# EAGLE board UCirKitBreadboardWithEverythingTop_2Layers-08201626 (EAGLE 7.3.0), part 1 of 2
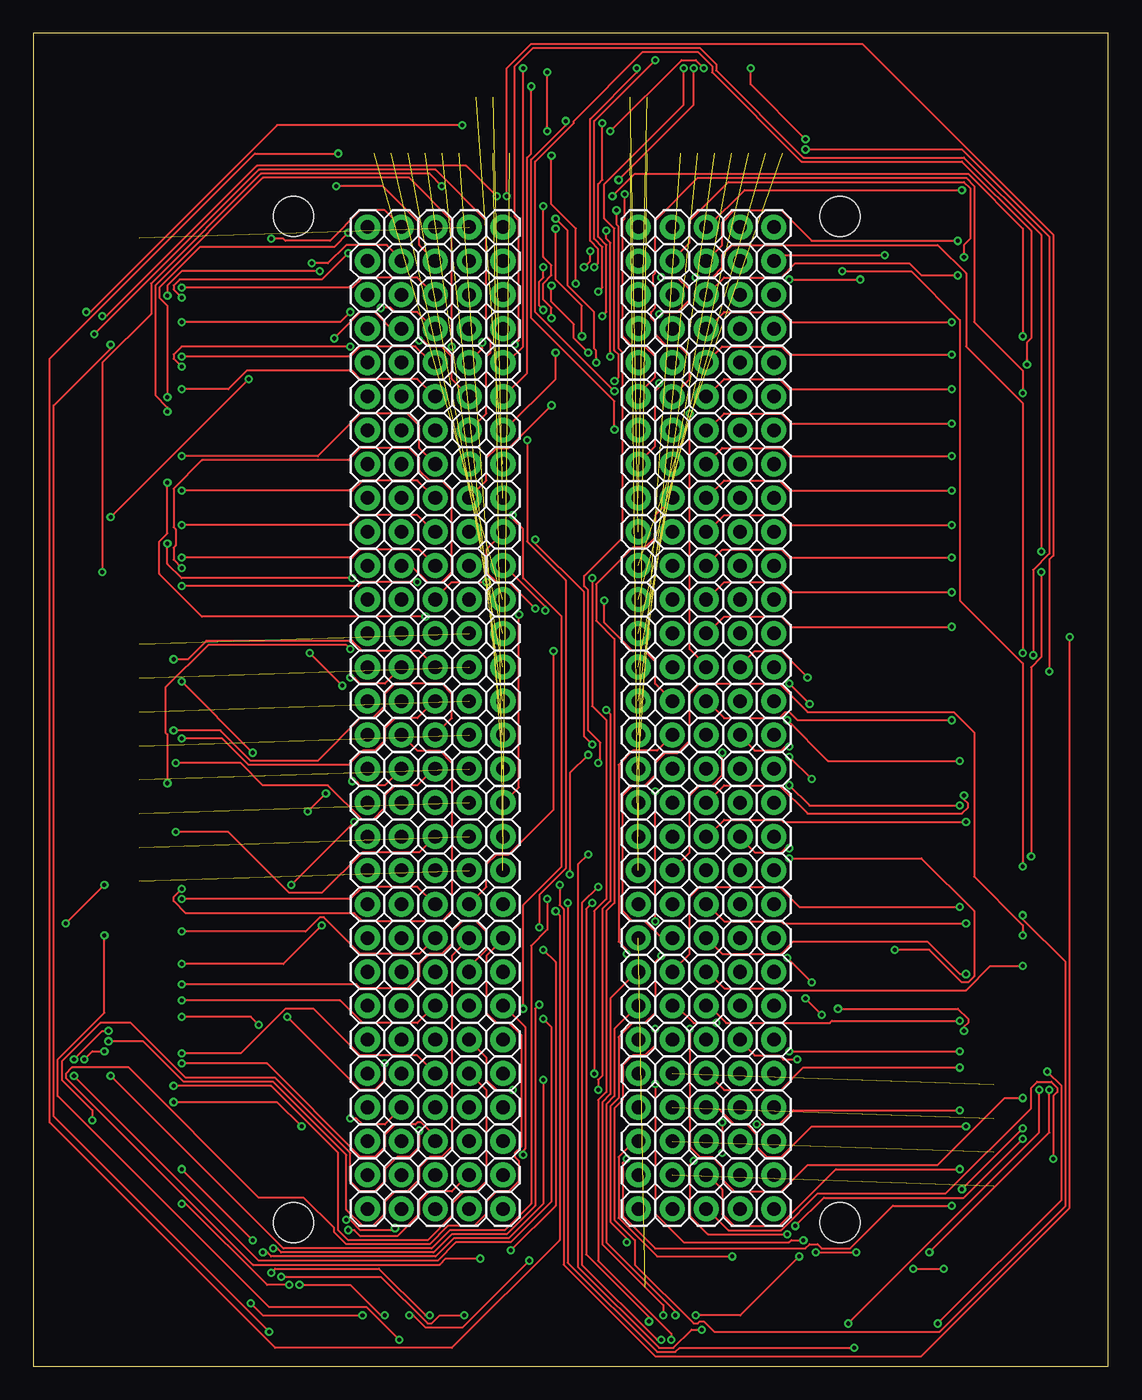
[diagram p2: board, top side]
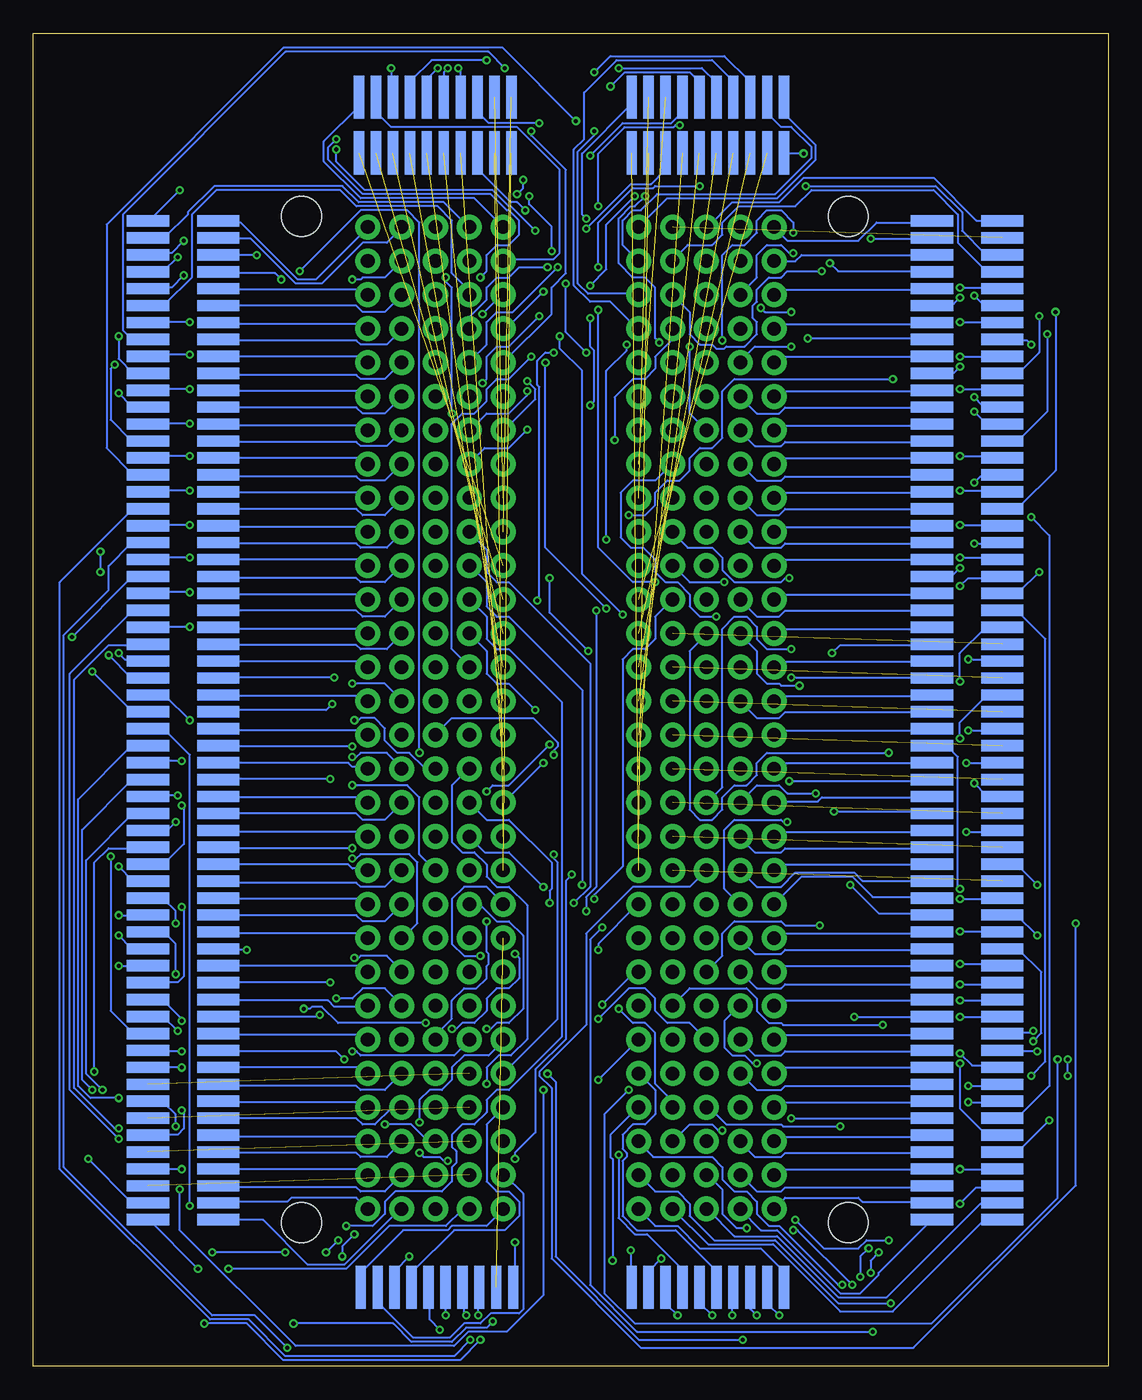
[diagram p3: board, bottom side, seen from below]

Size 80.62 x 100 mm. Coordinates in mm from the lower left corner, seen from the top.
Outline: 0,0 80.62,0 80.62,100 0,100 0,0
Copper layers (1*16): Top 0.035mm / dielectric 1.5mm / Bottom 0.035mm
Design rules "SeeedStudio_2layer_DRU_no_angle_20140221": minimum track width 6mil, minimum drill 12mil, track to track 6mil, track to pad 6mil, pad to pad 6mil, via to via 6mil, smd to smd 0mil, copper to edge 10mil, drill to drill 10mil, minimum pad ring 10mil, minimum via ring 6mil, stop-mask expansion 2mil, vias tented up to drill 100mil, thermal gap 10mil
Holes 3 mm at 19.51,86.27 19.51,10.77 60.51,10.77 60.51,86.27

## Footprints (pad centres in the part's own frame; a part is rotated, then mirrored left to right if it is on the bottom)
1X01_WITHOUT_TEXT = drill 1.016 pad 1.88: 1 0,0
1X01_SMD_3.25X0.85MM_NO_SILK = smd 3.25 x 0.85: P$1 0,0

## Placement (x,y rotation side)
JP1  [1X01_WITHOUT_TEXT]  25.06,85.46 0 top
JP2  [1X01_WITHOUT_TEXT]  27.6,85.46 0 top
JP3  [1X01_WITHOUT_TEXT]  30.14,85.46 0 top
JP4  [1X01_WITHOUT_TEXT]  32.68,85.46 0 top
JP5  [1X01_WITHOUT_TEXT]  35.22,85.46 0 top
JP6  [1X01_WITHOUT_TEXT]  45.38,85.46 0 top
JP7  [1X01_WITHOUT_TEXT]  47.92,85.46 0 top
JP8  [1X01_WITHOUT_TEXT]  50.46,85.46 0 top
JP9  [1X01_WITHOUT_TEXT]  53,85.46 0 top
JP10  [1X01_WITHOUT_TEXT]  55.54,85.46 0 top
JP11  [1X01_WITHOUT_TEXT]  25.06,82.92 0 top
JP12  [1X01_WITHOUT_TEXT]  27.6,82.92 0 top
JP13  [1X01_WITHOUT_TEXT]  30.14,82.92 0 top
JP14  [1X01_WITHOUT_TEXT]  32.68,82.92 0 top
JP15  [1X01_WITHOUT_TEXT]  35.22,82.92 0 top
JP16  [1X01_WITHOUT_TEXT]  45.38,82.92 0 top
JP17  [1X01_WITHOUT_TEXT]  47.92,82.92 0 top
JP18  [1X01_WITHOUT_TEXT]  50.46,82.92 0 top
JP19  [1X01_WITHOUT_TEXT]  53,82.92 0 top
JP20  [1X01_WITHOUT_TEXT]  55.54,82.92 0 top
JP21  [1X01_WITHOUT_TEXT]  25.06,80.38 0 top
JP22  [1X01_WITHOUT_TEXT]  27.6,80.38 0 top
JP23  [1X01_WITHOUT_TEXT]  30.14,80.38 0 top
JP24  [1X01_WITHOUT_TEXT]  32.68,80.38 0 top
JP25  [1X01_WITHOUT_TEXT]  35.22,80.38 0 top
JP26  [1X01_WITHOUT_TEXT]  45.38,80.38 0 top
JP27  [1X01_WITHOUT_TEXT]  47.92,80.38 0 top
JP28  [1X01_WITHOUT_TEXT]  50.46,80.38 0 top
JP29  [1X01_WITHOUT_TEXT]  53,80.38 0 top
JP30  [1X01_WITHOUT_TEXT]  55.54,80.38 0 top
JP31  [1X01_WITHOUT_TEXT]  25.06,77.84 0 top
JP32  [1X01_WITHOUT_TEXT]  27.6,77.84 0 top
JP33  [1X01_WITHOUT_TEXT]  30.14,77.84 0 top
JP34  [1X01_WITHOUT_TEXT]  32.68,77.84 0 top
JP35  [1X01_WITHOUT_TEXT]  35.22,77.84 0 top
JP36  [1X01_WITHOUT_TEXT]  45.38,77.84 0 top
JP37  [1X01_WITHOUT_TEXT]  47.92,77.84 0 top
JP38  [1X01_WITHOUT_TEXT]  50.46,77.84 0 top
JP39  [1X01_WITHOUT_TEXT]  53,77.84 0 top
JP40  [1X01_WITHOUT_TEXT]  55.54,77.84 0 top
JP41  [1X01_WITHOUT_TEXT]  25.06,75.3 0 top
JP42  [1X01_WITHOUT_TEXT]  27.6,75.3 0 top
JP43  [1X01_WITHOUT_TEXT]  30.14,75.3 0 top
JP44  [1X01_WITHOUT_TEXT]  32.68,75.3 0 top
JP45  [1X01_WITHOUT_TEXT]  35.22,75.3 0 top
JP46  [1X01_WITHOUT_TEXT]  45.38,75.3 0 top
JP47  [1X01_WITHOUT_TEXT]  47.92,75.3 0 top
JP48  [1X01_WITHOUT_TEXT]  50.46,75.3 0 top
JP49  [1X01_WITHOUT_TEXT]  53,75.3 0 top
JP50  [1X01_WITHOUT_TEXT]  55.54,75.3 0 top
JP51  [1X01_WITHOUT_TEXT]  25.06,72.76 0 top
JP52  [1X01_WITHOUT_TEXT]  27.6,72.76 0 top
JP53  [1X01_WITHOUT_TEXT]  30.14,72.76 0 top
JP54  [1X01_WITHOUT_TEXT]  32.68,72.76 0 top
JP55  [1X01_WITHOUT_TEXT]  35.22,72.76 0 top
JP56  [1X01_WITHOUT_TEXT]  45.38,72.76 0 top
JP57  [1X01_WITHOUT_TEXT]  47.92,72.76 0 top
JP58  [1X01_WITHOUT_TEXT]  50.46,72.76 0 top
JP59  [1X01_WITHOUT_TEXT]  53,72.76 0 top
JP60  [1X01_WITHOUT_TEXT]  55.54,72.76 0 top
JP61  [1X01_WITHOUT_TEXT]  25.06,70.22 0 top
JP62  [1X01_WITHOUT_TEXT]  27.6,70.22 0 top
JP63  [1X01_WITHOUT_TEXT]  30.14,70.22 0 top
JP64  [1X01_WITHOUT_TEXT]  32.68,70.22 0 top
JP65  [1X01_WITHOUT_TEXT]  35.22,70.22 0 top
JP66  [1X01_WITHOUT_TEXT]  45.38,70.22 0 top
JP67  [1X01_WITHOUT_TEXT]  47.92,70.22 0 top
JP68  [1X01_WITHOUT_TEXT]  50.46,70.22 0 top
JP69  [1X01_WITHOUT_TEXT]  53,70.22 0 top
JP70  [1X01_WITHOUT_TEXT]  55.54,70.22 0 top
JP71  [1X01_WITHOUT_TEXT]  25.06,67.68 0 top
JP72  [1X01_WITHOUT_TEXT]  27.6,67.68 0 top
JP73  [1X01_WITHOUT_TEXT]  30.14,67.68 0 top
JP74  [1X01_WITHOUT_TEXT]  32.68,67.68 0 top
JP75  [1X01_WITHOUT_TEXT]  35.22,67.68 0 top
JP76  [1X01_WITHOUT_TEXT]  45.38,67.68 0 top
JP77  [1X01_WITHOUT_TEXT]  47.92,67.68 0 top
JP78  [1X01_WITHOUT_TEXT]  50.46,67.68 0 top
JP79  [1X01_WITHOUT_TEXT]  53,67.68 0 top
JP80  [1X01_WITHOUT_TEXT]  55.54,67.68 0 top
JP81  [1X01_WITHOUT_TEXT]  25.06,65.14 0 top
JP82  [1X01_WITHOUT_TEXT]  27.6,65.14 0 top
JP83  [1X01_WITHOUT_TEXT]  30.14,65.14 0 top
JP84  [1X01_WITHOUT_TEXT]  32.68,65.14 0 top
JP85  [1X01_WITHOUT_TEXT]  35.22,65.14 0 top
JP86  [1X01_WITHOUT_TEXT]  45.38,65.14 0 top
JP87  [1X01_WITHOUT_TEXT]  47.92,65.14 0 top
JP88  [1X01_WITHOUT_TEXT]  50.46,65.14 0 top
JP89  [1X01_WITHOUT_TEXT]  53,65.14 0 top
JP90  [1X01_WITHOUT_TEXT]  55.54,65.14 0 top
JP91  [1X01_WITHOUT_TEXT]  25.06,62.6 0 top
JP92  [1X01_WITHOUT_TEXT]  27.6,62.6 0 top
JP93  [1X01_WITHOUT_TEXT]  30.14,62.6 0 top
JP94  [1X01_WITHOUT_TEXT]  32.68,62.6 0 top
JP95  [1X01_WITHOUT_TEXT]  35.22,62.6 0 top
JP96  [1X01_WITHOUT_TEXT]  45.38,62.6 0 top
JP97  [1X01_WITHOUT_TEXT]  47.92,62.6 0 top
JP98  [1X01_WITHOUT_TEXT]  50.46,62.6 0 top
JP99  [1X01_WITHOUT_TEXT]  53,62.6 0 top
JP100  [1X01_WITHOUT_TEXT]  55.54,62.6 0 top
JP101  [1X01_WITHOUT_TEXT]  25.06,60.06 0 top
JP102  [1X01_WITHOUT_TEXT]  27.6,60.06 0 top
JP103  [1X01_WITHOUT_TEXT]  30.14,60.06 0 top
JP104  [1X01_WITHOUT_TEXT]  32.68,60.06 0 top
JP105  [1X01_WITHOUT_TEXT]  35.22,60.06 0 top
JP106  [1X01_WITHOUT_TEXT]  45.38,60.06 0 top
JP107  [1X01_WITHOUT_TEXT]  47.92,60.06 0 top
JP108  [1X01_WITHOUT_TEXT]  50.46,60.06 0 top
JP109  [1X01_WITHOUT_TEXT]  53,60.06 0 top
JP110  [1X01_WITHOUT_TEXT]  55.54,60.06 0 top
JP111  [1X01_WITHOUT_TEXT]  25.06,57.52 0 top
JP112  [1X01_WITHOUT_TEXT]  27.6,57.52 0 top
JP113  [1X01_WITHOUT_TEXT]  30.14,57.52 0 top
JP114  [1X01_WITHOUT_TEXT]  32.68,57.52 0 top
JP115  [1X01_WITHOUT_TEXT]  35.22,57.52 0 top
JP116  [1X01_WITHOUT_TEXT]  45.38,57.52 0 top
JP117  [1X01_WITHOUT_TEXT]  47.92,57.52 0 top
JP118  [1X01_WITHOUT_TEXT]  50.46,57.52 0 top
JP119  [1X01_WITHOUT_TEXT]  53,57.52 0 top
JP120  [1X01_WITHOUT_TEXT]  55.54,57.52 0 top
JP121  [1X01_WITHOUT_TEXT]  25.06,54.98 0 top
JP122  [1X01_WITHOUT_TEXT]  27.6,54.98 0 top
JP123  [1X01_WITHOUT_TEXT]  30.14,54.98 0 top
JP124  [1X01_WITHOUT_TEXT]  32.68,54.98 0 top
JP125  [1X01_WITHOUT_TEXT]  35.22,54.98 0 top
JP126  [1X01_WITHOUT_TEXT]  45.38,54.98 0 top
JP127  [1X01_WITHOUT_TEXT]  47.92,54.98 0 top
JP128  [1X01_WITHOUT_TEXT]  50.46,54.98 0 top
JP129  [1X01_WITHOUT_TEXT]  53,54.98 0 top
JP130  [1X01_WITHOUT_TEXT]  55.54,54.98 0 top
JP131  [1X01_WITHOUT_TEXT]  25.06,52.44 0 top
JP132  [1X01_WITHOUT_TEXT]  27.6,52.44 0 top
JP133  [1X01_WITHOUT_TEXT]  30.14,52.44 0 top
JP134  [1X01_WITHOUT_TEXT]  32.68,52.44 0 top
JP135  [1X01_WITHOUT_TEXT]  35.22,52.44 0 top
JP136  [1X01_WITHOUT_TEXT]  45.38,52.44 0 top
JP137  [1X01_WITHOUT_TEXT]  47.92,52.44 0 top
JP138  [1X01_WITHOUT_TEXT]  50.46,52.44 0 top
JP139  [1X01_WITHOUT_TEXT]  53,52.44 0 top
JP140  [1X01_WITHOUT_TEXT]  55.54,52.44 0 top
JP141  [1X01_WITHOUT_TEXT]  25.06,49.9 0 top
JP142  [1X01_WITHOUT_TEXT]  27.6,49.9 0 top
JP143  [1X01_WITHOUT_TEXT]  30.14,49.9 0 top
JP144  [1X01_WITHOUT_TEXT]  32.68,49.9 0 top
JP145  [1X01_WITHOUT_TEXT]  35.22,49.9 0 top
JP146  [1X01_WITHOUT_TEXT]  45.38,49.9 0 top
JP147  [1X01_WITHOUT_TEXT]  47.92,49.9 0 top
JP148  [1X01_WITHOUT_TEXT]  50.46,49.9 0 top
JP149  [1X01_WITHOUT_TEXT]  53,49.9 0 top
JP150  [1X01_WITHOUT_TEXT]  55.54,49.9 0 top
JP151  [1X01_WITHOUT_TEXT]  25.06,47.36 0 top
JP152  [1X01_WITHOUT_TEXT]  27.6,47.36 0 top
JP153  [1X01_WITHOUT_TEXT]  30.14,47.36 0 top
JP154  [1X01_WITHOUT_TEXT]  32.68,47.36 0 top
JP155  [1X01_WITHOUT_TEXT]  35.22,47.36 0 top
JP156  [1X01_WITHOUT_TEXT]  45.38,47.36 0 top
JP157  [1X01_WITHOUT_TEXT]  47.92,47.36 0 top
JP158  [1X01_WITHOUT_TEXT]  50.46,47.36 0 top
JP159  [1X01_WITHOUT_TEXT]  53,47.36 0 top
JP160  [1X01_WITHOUT_TEXT]  55.54,47.36 0 top
JP161  [1X01_WITHOUT_TEXT]  25.06,44.82 0 top
JP162  [1X01_WITHOUT_TEXT]  27.6,44.82 0 top
JP163  [1X01_WITHOUT_TEXT]  30.14,44.82 0 top
JP164  [1X01_WITHOUT_TEXT]  32.68,44.82 0 top
JP165  [1X01_WITHOUT_TEXT]  35.22,44.82 0 top
JP166  [1X01_WITHOUT_TEXT]  45.38,44.82 0 top
JP167  [1X01_WITHOUT_TEXT]  47.92,44.82 0 top
JP168  [1X01_WITHOUT_TEXT]  50.46,44.82 0 top
JP169  [1X01_WITHOUT_TEXT]  53,44.82 0 top
JP170  [1X01_WITHOUT_TEXT]  55.54,44.82 0 top
JP171  [1X01_WITHOUT_TEXT]  25.06,42.28 0 top
JP172  [1X01_WITHOUT_TEXT]  27.6,42.28 0 top
JP173  [1X01_WITHOUT_TEXT]  30.14,42.28 0 top
JP174  [1X01_WITHOUT_TEXT]  32.68,42.28 0 top
JP175  [1X01_WITHOUT_TEXT]  35.22,42.28 0 top
JP176  [1X01_WITHOUT_TEXT]  45.38,42.28 0 top
JP177  [1X01_WITHOUT_TEXT]  47.92,42.28 0 top
JP178  [1X01_WITHOUT_TEXT]  50.46,42.28 0 top
JP179  [1X01_WITHOUT_TEXT]  53,42.28 0 top
JP180  [1X01_WITHOUT_TEXT]  55.54,42.28 0 top
JP181  [1X01_WITHOUT_TEXT]  25.06,39.74 0 top
JP182  [1X01_WITHOUT_TEXT]  27.6,39.74 0 top
JP183  [1X01_WITHOUT_TEXT]  30.14,39.74 0 top
JP184  [1X01_WITHOUT_TEXT]  32.68,39.74 0 top
JP185  [1X01_WITHOUT_TEXT]  35.22,39.74 0 top
JP186  [1X01_WITHOUT_TEXT]  45.38,39.74 0 top
JP187  [1X01_WITHOUT_TEXT]  47.92,39.74 0 top
JP188  [1X01_WITHOUT_TEXT]  50.46,39.74 0 top
JP189  [1X01_WITHOUT_TEXT]  53,39.74 0 top
JP190  [1X01_WITHOUT_TEXT]  55.54,39.74 0 top
JP191  [1X01_WITHOUT_TEXT]  25.06,37.2 0 top
JP192  [1X01_WITHOUT_TEXT]  27.6,37.2 0 top
JP193  [1X01_WITHOUT_TEXT]  30.14,37.2 0 top
JP194  [1X01_WITHOUT_TEXT]  32.68,37.2 0 top
JP195  [1X01_WITHOUT_TEXT]  35.22,37.2 0 top
JP196  [1X01_WITHOUT_TEXT]  45.38,37.2 0 top
JP197  [1X01_WITHOUT_TEXT]  47.92,37.2 0 top
JP198  [1X01_WITHOUT_TEXT]  50.46,37.2 0 top
JP199  [1X01_WITHOUT_TEXT]  53,37.2 0 top
JP200  [1X01_WITHOUT_TEXT]  55.54,37.2 0 top
JP201  [1X01_WITHOUT_TEXT]  25.06,34.66 0 top
JP202  [1X01_WITHOUT_TEXT]  27.6,34.66 0 top
JP203  [1X01_WITHOUT_TEXT]  30.14,34.66 0 top
JP204  [1X01_WITHOUT_TEXT]  32.68,34.66 0 top
JP205  [1X01_WITHOUT_TEXT]  35.22,34.66 0 top
JP206  [1X01_WITHOUT_TEXT]  45.38,34.66 0 top
JP207  [1X01_WITHOUT_TEXT]  47.92,34.66 0 top
JP208  [1X01_WITHOUT_TEXT]  50.46,34.66 0 top
JP209  [1X01_WITHOUT_TEXT]  53,34.66 0 top
JP210  [1X01_WITHOUT_TEXT]  55.54,34.66 0 top
JP211  [1X01_WITHOUT_TEXT]  25.06,32.12 0 top
JP212  [1X01_WITHOUT_TEXT]  27.6,32.12 0 top
JP213  [1X01_WITHOUT_TEXT]  30.14,32.12 0 top
JP214  [1X01_WITHOUT_TEXT]  32.68,32.12 0 top
JP215  [1X01_WITHOUT_TEXT]  35.22,32.12 0 top
JP216  [1X01_WITHOUT_TEXT]  45.38,32.12 0 top
JP217  [1X01_WITHOUT_TEXT]  47.92,32.12 0 top
JP218  [1X01_WITHOUT_TEXT]  50.46,32.12 0 top
JP219  [1X01_WITHOUT_TEXT]  53,32.12 0 top
JP220  [1X01_WITHOUT_TEXT]  55.54,32.12 0 top
JP221  [1X01_WITHOUT_TEXT]  25.06,29.58 0 top
JP222  [1X01_WITHOUT_TEXT]  27.6,29.58 0 top
JP223  [1X01_WITHOUT_TEXT]  30.14,29.58 0 top
JP224  [1X01_WITHOUT_TEXT]  32.68,29.58 0 top
JP225  [1X01_WITHOUT_TEXT]  35.22,29.58 0 top
JP226  [1X01_WITHOUT_TEXT]  45.38,29.58 0 top
JP227  [1X01_WITHOUT_TEXT]  47.92,29.58 0 top
JP228  [1X01_WITHOUT_TEXT]  50.46,29.58 0 top
JP229  [1X01_WITHOUT_TEXT]  53,29.58 0 top
JP230  [1X01_WITHOUT_TEXT]  55.54,29.58 0 top
JP231  [1X01_WITHOUT_TEXT]  25.06,27.04 0 top
JP232  [1X01_WITHOUT_TEXT]  27.6,27.04 0 top
JP233  [1X01_WITHOUT_TEXT]  30.14,27.04 0 top
JP234  [1X01_WITHOUT_TEXT]  32.68,27.04 0 top
JP235  [1X01_WITHOUT_TEXT]  35.22,27.04 0 top
JP236  [1X01_WITHOUT_TEXT]  45.38,27.04 0 top
JP237  [1X01_WITHOUT_TEXT]  47.92,27.04 0 top
JP238  [1X01_WITHOUT_TEXT]  50.46,27.04 0 top
JP239  [1X01_WITHOUT_TEXT]  53,27.04 0 top
JP240  [1X01_WITHOUT_TEXT]  55.54,27.04 0 top
JP241  [1X01_WITHOUT_TEXT]  25.06,24.5 0 top
JP242  [1X01_WITHOUT_TEXT]  27.6,24.5 0 top
JP243  [1X01_WITHOUT_TEXT]  30.14,24.5 0 top
JP244  [1X01_WITHOUT_TEXT]  32.68,24.5 0 top
JP245  [1X01_WITHOUT_TEXT]  35.22,24.5 0 top
JP246  [1X01_WITHOUT_TEXT]  45.38,24.5 0 top
JP247  [1X01_WITHOUT_TEXT]  47.92,24.5 0 top
JP248  [1X01_WITHOUT_TEXT]  50.46,24.5 0 top
JP249  [1X01_WITHOUT_TEXT]  53,24.5 0 top
JP250  [1X01_WITHOUT_TEXT]  55.54,24.5 0 top
JP251  [1X01_WITHOUT_TEXT]  25.06,21.96 0 top
JP252  [1X01_WITHOUT_TEXT]  27.6,21.96 0 top
JP253  [1X01_WITHOUT_TEXT]  30.14,21.96 0 top
JP254  [1X01_WITHOUT_TEXT]  32.68,21.96 0 top
JP255  [1X01_WITHOUT_TEXT]  35.22,21.96 0 top
JP256  [1X01_WITHOUT_TEXT]  45.38,21.96 0 top
JP257  [1X01_WITHOUT_TEXT]  47.92,21.96 0 top
JP258  [1X01_WITHOUT_TEXT]  50.46,21.96 0 top
JP259  [1X01_WITHOUT_TEXT]  53,21.96 0 top
JP260  [1X01_WITHOUT_TEXT]  55.54,21.96 0 top
JP261  [1X01_WITHOUT_TEXT]  25.06,19.42 0 top
JP262  [1X01_WITHOUT_TEXT]  27.6,19.42 0 top
JP263  [1X01_WITHOUT_TEXT]  30.14,19.42 0 top
JP264  [1X01_WITHOUT_TEXT]  32.68,19.42 0 top
JP265  [1X01_WITHOUT_TEXT]  35.22,19.42 0 top
JP266  [1X01_WITHOUT_TEXT]  45.38,19.42 0 top
JP267  [1X01_WITHOUT_TEXT]  47.92,19.42 0 top
JP268  [1X01_WITHOUT_TEXT]  50.46,19.42 0 top
JP269  [1X01_WITHOUT_TEXT]  53,19.42 0 top
JP270  [1X01_WITHOUT_TEXT]  55.54,19.42 0 top
JP271  [1X01_WITHOUT_TEXT]  25.06,16.88 0 top
JP272  [1X01_WITHOUT_TEXT]  27.6,16.88 0 top
JP273  [1X01_WITHOUT_TEXT]  30.14,16.88 0 top
JP274  [1X01_WITHOUT_TEXT]  32.68,16.88 0 top
JP275  [1X01_WITHOUT_TEXT]  35.22,16.88 0 top
JP276  [1X01_WITHOUT_TEXT]  45.38,16.88 0 top
JP277  [1X01_WITHOUT_TEXT]  47.92,16.88 0 top
JP278  [1X01_WITHOUT_TEXT]  50.46,16.88 0 top
JP279  [1X01_WITHOUT_TEXT]  53,16.88 0 top
JP280  [1X01_WITHOUT_TEXT]  55.54,16.88 0 top
JP281  [1X01_WITHOUT_TEXT]  25.06,14.34 0 top
JP282  [1X01_WITHOUT_TEXT]  27.6,14.34 0 top
JP283  [1X01_WITHOUT_TEXT]  30.14,14.34 0 top
JP284  [1X01_WITHOUT_TEXT]  32.68,14.34 0 top
JP285  [1X01_WITHOUT_TEXT]  35.22,14.34 0 top
JP286  [1X01_WITHOUT_TEXT]  45.38,14.34 0 top
JP287  [1X01_WITHOUT_TEXT]  47.92,14.34 0 top
JP288  [1X01_WITHOUT_TEXT]  50.46,14.34 0 top
JP289  [1X01_WITHOUT_TEXT]  53,14.34 0 top
JP290  [1X01_WITHOUT_TEXT]  55.54,14.34 0 top
JP291  [1X01_WITHOUT_TEXT]  25.06,11.8 0 top
JP292  [1X01_WITHOUT_TEXT]  27.6,11.8 0 top
JP293  [1X01_WITHOUT_TEXT]  30.14,11.8 0 top
JP294  [1X01_WITHOUT_TEXT]  32.68,11.8 0 top
JP295  [1X01_WITHOUT_TEXT]  35.22,11.8 0 top
JP296  [1X01_WITHOUT_TEXT]  45.38,11.8 0 top
JP297  [1X01_WITHOUT_TEXT]  47.92,11.8 0 top
JP298  [1X01_WITHOUT_TEXT]  50.46,11.8 0 top
JP299  [1X01_WITHOUT_TEXT]  53,11.8 0 top
JP300  [1X01_WITHOUT_TEXT]  55.54,11.8 0 top
JP901  [1X01_SMD_3.25X0.85MM_NO_SILK]  7.96,85.92 0 bottom
JP902  [1X01_SMD_3.25X0.85MM_NO_SILK]  7.96,84.65 0 bottom
JP903  [1X01_SMD_3.25X0.85MM_NO_SILK]  7.96,83.38 0 bottom
JP904  [1X01_SMD_3.25X0.85MM_NO_SILK]  7.96,82.11 0 bottom
JP905  [1X01_SMD_3.25X0.85MM_NO_SILK]  7.96,80.84 0 bottom
JP906  [1X01_SMD_3.25X0.85MM_NO_SILK]  7.96,79.57 0 bottom
JP907  [1X01_SMD_3.25X0.85MM_NO_SILK]  7.96,78.3 0 bottom
JP908  [1X01_SMD_3.25X0.85MM_NO_SILK]  7.96,77.03 0 bottom
JP909  [1X01_SMD_3.25X0.85MM_NO_SILK]  7.96,75.76 0 bottom
JP910  [1X01_SMD_3.25X0.85MM_NO_SILK]  7.96,74.49 0 bottom
JP911  [1X01_SMD_3.25X0.85MM_NO_SILK]  7.96,73.22 0 bottom
JP912  [1X01_SMD_3.25X0.85MM_NO_SILK]  7.96,71.95 0 bottom
JP913  [1X01_SMD_3.25X0.85MM_NO_SILK]  7.96,70.68 0 bottom
JP914  [1X01_SMD_3.25X0.85MM_NO_SILK]  7.96,69.41 0 bottom
JP915  [1X01_SMD_3.25X0.85MM_NO_SILK]  7.96,68.14 0 bottom
JP916  [1X01_SMD_3.25X0.85MM_NO_SILK]  7.96,66.87 0 bottom
JP917  [1X01_SMD_3.25X0.85MM_NO_SILK]  7.96,65.6 0 bottom
JP918  [1X01_SMD_3.25X0.85MM_NO_SILK]  7.96,64.33 0 bottom
JP919  [1X01_SMD_3.25X0.85MM_NO_SILK]  7.96,63.06 0 bottom
JP920  [1X01_SMD_3.25X0.85MM_NO_SILK]  7.96,61.79 0 bottom
JP921  [1X01_SMD_3.25X0.85MM_NO_SILK]  7.96,60.52 0 bottom
JP922  [1X01_SMD_3.25X0.85MM_NO_SILK]  7.96,59.25 0 bottom
JP923  [1X01_SMD_3.25X0.85MM_NO_SILK]  7.96,57.98 0 bottom
JP924  [1X01_SMD_3.25X0.85MM_NO_SILK]  7.96,56.71 0 bottom
JP925  [1X01_SMD_3.25X0.85MM_NO_SILK]  7.96,55.44 0 bottom
JP926  [1X01_SMD_3.25X0.85MM_NO_SILK]  7.96,54.17 0 bottom
JP927  [1X01_SMD_3.25X0.85MM_NO_SILK]  7.96,52.9 0 bottom
JP928  [1X01_SMD_3.25X0.85MM_NO_SILK]  7.96,51.63 0 bottom
JP929  [1X01_SMD_3.25X0.85MM_NO_SILK]  7.96,50.36 0 bottom
JP930  [1X01_SMD_3.25X0.85MM_NO_SILK]  7.96,49.09 0 bottom
JP931  [1X01_SMD_3.25X0.85MM_NO_SILK]  7.96,47.82 0 bottom
JP932  [1X01_SMD_3.25X0.85MM_NO_SILK]  7.96,46.55 0 bottom
JP933  [1X01_SMD_3.25X0.85MM_NO_SILK]  7.96,45.28 0 bottom
JP934  [1X01_SMD_3.25X0.85MM_NO_SILK]  7.96,44.01 0 bottom
JP935  [1X01_SMD_3.25X0.85MM_NO_SILK]  7.96,42.74 0 bottom
JP936  [1X01_SMD_3.25X0.85MM_NO_SILK]  7.96,41.47 0 bottom
JP937  [1X01_SMD_3.25X0.85MM_NO_SILK]  7.96,40.2 0 bottom
JP938  [1X01_SMD_3.25X0.85MM_NO_SILK]  7.96,38.93 0 bottom
JP939  [1X01_SMD_3.25X0.85MM_NO_SILK]  7.96,37.66 0 bottom
JP940  [1X01_SMD_3.25X0.85MM_NO_SILK]  7.96,36.39 0 bottom
JP941  [1X01_SMD_3.25X0.85MM_NO_SILK]  7.96,35.12 0 bottom
JP942  [1X01_SMD_3.25X0.85MM_NO_SILK]  7.96,33.85 0 bottom
JP943  [1X01_SMD_3.25X0.85MM_NO_SILK]  7.96,32.58 0 bottom
JP944  [1X01_SMD_3.25X0.85MM_NO_SILK]  7.96,31.31 0 bottom
JP945  [1X01_SMD_3.25X0.85MM_NO_SILK]  7.96,30.04 0 bottom
JP946  [1X01_SMD_3.25X0.85MM_NO_SILK]  7.96,28.77 0 bottom
JP947  [1X01_SMD_3.25X0.85MM_NO_SILK]  7.96,27.5 0 bottom
JP948  [1X01_SMD_3.25X0.85MM_NO_SILK]  7.96,26.23 0 bottom
JP949  [1X01_SMD_3.25X0.85MM_NO_SILK]  7.96,24.96 0 bottom
JP950  [1X01_SMD_3.25X0.85MM_NO_SILK]  7.96,23.69 0 bottom
JP951  [1X01_SMD_3.25X0.85MM_NO_SILK]  7.96,22.42 0 bottom
JP952  [1X01_SMD_3.25X0.85MM_NO_SILK]  7.96,21.15 0 bottom
JP953  [1X01_SMD_3.25X0.85MM_NO_SILK]  7.96,19.88 0 bottom
JP954  [1X01_SMD_3.25X0.85MM_NO_SILK]  7.96,18.61 0 bottom
JP955  [1X01_SMD_3.25X0.85MM_NO_SILK]  7.96,17.34 0 bottom
JP956  [1X01_SMD_3.25X0.85MM_NO_SILK]  7.96,16.07 0 bottom
JP957  [1X01_SMD_3.25X0.85MM_NO_SILK]  7.96,14.8 0 bottom
JP958  [1X01_SMD_3.25X0.85MM_NO_SILK]  7.96,13.53 0 bottom
JP959  [1X01_SMD_3.25X0.85MM_NO_SILK]  7.96,12.26 0 bottom
JP960  [1X01_SMD_3.25X0.85MM_NO_SILK]  7.96,10.99 0 bottom
JP961  [1X01_SMD_3.25X0.85MM_NO_SILK]  13.23,85.92 0 bottom
JP962  [1X01_SMD_3.25X0.85MM_NO_SILK]  13.23,84.65 0 bottom
JP963  [1X01_SMD_3.25X0.85MM_NO_SILK]  13.23,83.38 0 bottom
JP964  [1X01_SMD_3.25X0.85MM_NO_SILK]  13.23,82.11 0 bottom
JP965  [1X01_SMD_3.25X0.85MM_NO_SILK]  13.23,80.84 0 bottom
JP966  [1X01_SMD_3.25X0.85MM_NO_SILK]  13.23,79.57 0 bottom
JP967  [1X01_SMD_3.25X0.85MM_NO_SILK]  13.23,78.3 0 bottom
JP968  [1X01_SMD_3.25X0.85MM_NO_SILK]  13.23,77.03 0 bottom
JP969  [1X01_SMD_3.25X0.85MM_NO_SILK]  13.23,75.76 0 bottom
JP970  [1X01_SMD_3.25X0.85MM_NO_SILK]  13.23,74.49 0 bottom
JP971  [1X01_SMD_3.25X0.85MM_NO_SILK]  13.23,73.22 0 bottom
JP972  [1X01_SMD_3.25X0.85MM_NO_SILK]  13.23,71.95 0 bottom
JP973  [1X01_SMD_3.25X0.85MM_NO_SILK]  13.23,70.68 0 bottom
JP974  [1X01_SMD_3.25X0.85MM_NO_SILK]  13.23,69.41 0 bottom
JP975  [1X01_SMD_3.25X0.85MM_NO_SILK]  13.23,68.14 0 bottom
JP976  [1X01_SMD_3.25X0.85MM_NO_SILK]  13.23,66.87 0 bottom
JP977  [1X01_SMD_3.25X0.85MM_NO_SILK]  13.23,65.6 0 bottom
JP978  [1X01_SMD_3.25X0.85MM_NO_SILK]  13.23,64.33 0 bottom
JP979  [1X01_SMD_3.25X0.85MM_NO_SILK]  13.23,63.06 0 bottom
JP980  [1X01_SMD_3.25X0.85MM_NO_SILK]  13.23,61.79 0 bottom
JP981  [1X01_SMD_3.25X0.85MM_NO_SILK]  13.23,60.52 0 bottom
JP982  [1X01_SMD_3.25X0.85MM_NO_SILK]  13.23,59.25 0 bottom
JP983  [1X01_SMD_3.25X0.85MM_NO_SILK]  13.23,57.98 0 bottom
JP984  [1X01_SMD_3.25X0.85MM_NO_SILK]  13.23,56.71 0 bottom
JP985  [1X01_SMD_3.25X0.85MM_NO_SILK]  13.23,55.44 0 bottom
JP986  [1X01_SMD_3.25X0.85MM_NO_SILK]  13.23,54.17 0 bottom
JP987  [1X01_SMD_3.25X0.85MM_NO_SILK]  13.23,52.9 0 bottom
JP988  [1X01_SMD_3.25X0.85MM_NO_SILK]  13.23,51.63 0 bottom
JP989  [1X01_SMD_3.25X0.85MM_NO_SILK]  13.23,50.36 0 bottom
JP990  [1X01_SMD_3.25X0.85MM_NO_SILK]  13.23,49.09 0 bottom
JP991  [1X01_SMD_3.25X0.85MM_NO_SILK]  13.23,47.82 0 bottom
JP992  [1X01_SMD_3.25X0.85MM_NO_SILK]  13.23,46.55 0 bottom
JP993  [1X01_SMD_3.25X0.85MM_NO_SILK]  13.23,45.28 0 bottom
JP994  [1X01_SMD_3.25X0.85MM_NO_SILK]  13.23,44.01 0 bottom
JP995  [1X01_SMD_3.25X0.85MM_NO_SILK]  13.23,42.74 0 bottom
JP996  [1X01_SMD_3.25X0.85MM_NO_SILK]  13.23,41.47 0 bottom
JP997  [1X01_SMD_3.25X0.85MM_NO_SILK]  13.23,40.2 0 bottom
JP998  [1X01_SMD_3.25X0.85MM_NO_SILK]  13.23,38.93 0 bottom
JP999  [1X01_SMD_3.25X0.85MM_NO_SILK]  13.23,37.66 0 bottom
JP1000  [1X01_SMD_3.25X0.85MM_NO_SILK]  13.23,36.39 0 bottom
JP1001  [1X01_SMD_3.25X0.85MM_NO_SILK]  13.23,35.12 0 bottom
JP1002  [1X01_SMD_3.25X0.85MM_NO_SILK]  13.23,33.85 0 bottom
JP1003  [1X01_SMD_3.25X0.85MM_NO_SILK]  13.23,32.58 0 bottom
JP1004  [1X01_SMD_3.25X0.85MM_NO_SILK]  13.23,31.31 0 bottom
JP1005  [1X01_SMD_3.25X0.85MM_NO_SILK]  13.23,30.04 0 bottom
JP1006  [1X01_SMD_3.25X0.85MM_NO_SILK]  13.23,28.77 0 bottom
JP1007  [1X01_SMD_3.25X0.85MM_NO_SILK]  13.23,27.5 0 bottom
JP1008  [1X01_SMD_3.25X0.85MM_NO_SILK]  13.23,26.23 0 bottom
JP1009  [1X01_SMD_3.25X0.85MM_NO_SILK]  13.23,24.96 0 bottom
JP1010  [1X01_SMD_3.25X0.85MM_NO_SILK]  13.23,23.69 0 bottom
JP1011  [1X01_SMD_3.25X0.85MM_NO_SILK]  13.23,22.42 0 bottom
JP1012  [1X01_SMD_3.25X0.85MM_NO_SILK]  13.23,21.15 0 bottom
JP1013  [1X01_SMD_3.25X0.85MM_NO_SILK]  13.23,19.88 0 bottom
JP1014  [1X01_SMD_3.25X0.85MM_NO_SILK]  13.23,18.61 0 bottom
JP1015  [1X01_SMD_3.25X0.85MM_NO_SILK]  13.23,17.34 0 bottom
JP1016  [1X01_SMD_3.25X0.85MM_NO_SILK]  13.23,16.07 0 bottom
JP1017  [1X01_SMD_3.25X0.85MM_NO_SILK]  13.23,14.8 0 bottom
JP1018  [1X01_SMD_3.25X0.85MM_NO_SILK]  13.23,13.53 0 bottom
JP1019  [1X01_SMD_3.25X0.85MM_NO_SILK]  13.23,12.26 0 bottom
JP1020  [1X01_SMD_3.25X0.85MM_NO_SILK]  13.23,10.99 0 bottom
JP1021  [1X01_SMD_3.25X0.85MM_NO_SILK]  66.76,85.92 0 bottom
JP1022  [1X01_SMD_3.25X0.85MM_NO_SILK]  66.76,84.65 0 bottom
JP1023  [1X01_SMD_3.25X0.85MM_NO_SILK]  66.76,83.38 0 bottom
JP1024  [1X01_SMD_3.25X0.85MM_NO_SILK]  66.76,82.11 0 bottom
JP1025  [1X01_SMD_3.25X0.85MM_NO_SILK]  66.76,80.84 0 bottom
JP1026  [1X01_SMD_3.25X0.85MM_NO_SILK]  66.76,79.57 0 bottom
JP1027  [1X01_SMD_3.25X0.85MM_NO_SILK]  66.76,78.3 0 bottom
JP1028  [1X01_SMD_3.25X0.85MM_NO_SILK]  66.76,77.03 0 bottom
JP1029  [1X01_SMD_3.25X0.85MM_NO_SILK]  66.76,75.76 0 bottom
JP1030  [1X01_SMD_3.25X0.85MM_NO_SILK]  66.76,74.49 0 bottom
JP1031  [1X01_SMD_3.25X0.85MM_NO_SILK]  66.76,73.22 0 bottom
JP1032  [1X01_SMD_3.25X0.85MM_NO_SILK]  66.76,71.95 0 bottom
JP1033  [1X01_SMD_3.25X0.85MM_NO_SILK]  66.76,70.68 0 bottom
JP1034  [1X01_SMD_3.25X0.85MM_NO_SILK]  66.76,69.41 0 bottom
JP1035  [1X01_SMD_3.25X0.85MM_NO_SILK]  66.76,68.14 0 bottom
JP1036  [1X01_SMD_3.25X0.85MM_NO_SILK]  66.76,66.87 0 bottom
JP1037  [1X01_SMD_3.25X0.85MM_NO_SILK]  66.76,65.6 0 bottom
JP1038  [1X01_SMD_3.25X0.85MM_NO_SILK]  66.76,64.33 0 bottom
JP1039  [1X01_SMD_3.25X0.85MM_NO_SILK]  66.76,63.06 0 bottom
JP1040  [1X01_SMD_3.25X0.85MM_NO_SILK]  66.76,61.79 0 bottom
JP1041  [1X01_SMD_3.25X0.85MM_NO_SILK]  66.76,60.52 0 bottom
JP1042  [1X01_SMD_3.25X0.85MM_NO_SILK]  66.76,59.25 0 bottom
JP1043  [1X01_SMD_3.25X0.85MM_NO_SILK]  66.76,57.98 0 bottom
JP1044  [1X01_SMD_3.25X0.85MM_NO_SILK]  66.76,56.71 0 bottom
JP1045  [1X01_SMD_3.25X0.85MM_NO_SILK]  66.76,55.44 0 bottom
JP1046  [1X01_SMD_3.25X0.85MM_NO_SILK]  66.76,54.17 0 bottom
JP1047  [1X01_SMD_3.25X0.85MM_NO_SILK]  66.76,52.9 0 bottom
JP1048  [1X01_SMD_3.25X0.85MM_NO_SILK]  66.76,51.63 0 bottom
JP1049  [1X01_SMD_3.25X0.85MM_NO_SILK]  66.76,50.36 0 bottom
JP1050  [1X01_SMD_3.25X0.85MM_NO_SILK]  66.76,49.09 0 bottom
JP1051  [1X01_SMD_3.25X0.85MM_NO_SILK]  66.76,47.82 0 bottom
JP1052  [1X01_SMD_3.25X0.85MM_NO_SILK]  66.76,46.55 0 bottom
JP1053  [1X01_SMD_3.25X0.85MM_NO_SILK]  66.76,45.28 0 bottom
JP1054  [1X01_SMD_3.25X0.85MM_NO_SILK]  66.76,44.01 0 bottom
JP1055  [1X01_SMD_3.25X0.85MM_NO_SILK]  66.76,42.74 0 bottom
JP1056  [1X01_SMD_3.25X0.85MM_NO_SILK]  66.76,41.47 0 bottom
JP1057  [1X01_SMD_3.25X0.85MM_NO_SILK]  66.76,40.2 0 bottom
JP1058  [1X01_SMD_3.25X0.85MM_NO_SILK]  66.76,38.93 0 bottom
JP1059  [1X01_SMD_3.25X0.85MM_NO_SILK]  66.76,37.66 0 bottom
JP1060  [1X01_SMD_3.25X0.85MM_NO_SILK]  66.76,36.39 0 bottom
JP1061  [1X01_SMD_3.25X0.85MM_NO_SILK]  66.76,35.12 0 bottom
JP1062  [1X01_SMD_3.25X0.85MM_NO_SILK]  66.76,33.85 0 bottom
JP1063  [1X01_SMD_3.25X0.85MM_NO_SILK]  66.76,32.58 0 bottom
JP1064  [1X01_SMD_3.25X0.85MM_NO_SILK]  66.76,31.31 0 bottom
JP1065  [1X01_SMD_3.25X0.85MM_NO_SILK]  66.76,30.04 0 bottom
JP1066  [1X01_SMD_3.25X0.85MM_NO_SILK]  66.76,28.77 0 bottom
JP1067  [1X01_SMD_3.25X0.85MM_NO_SILK]  66.76,27.5 0 bottom
JP1068  [1X01_SMD_3.25X0.85MM_NO_SILK]  66.76,26.23 0 bottom
JP1069  [1X01_SMD_3.25X0.85MM_NO_SILK]  66.76,24.96 0 bottom
JP1070  [1X01_SMD_3.25X0.85MM_NO_SILK]  66.76,23.69 0 bottom
JP1071  [1X01_SMD_3.25X0.85MM_NO_SILK]  66.76,22.42 0 bottom
JP1072  [1X01_SMD_3.25X0.85MM_NO_SILK]  66.76,21.15 0 bottom
JP1073  [1X01_SMD_3.25X0.85MM_NO_SILK]  66.76,19.88 0 bottom
JP1074  [1X01_SMD_3.25X0.85MM_NO_SILK]  66.76,18.61 0 bottom
JP1075  [1X01_SMD_3.25X0.85MM_NO_SILK]  66.76,17.34 0 bottom
JP1076  [1X01_SMD_3.25X0.85MM_NO_SILK]  66.76,16.07 0 bottom
JP1077  [1X01_SMD_3.25X0.85MM_NO_SILK]  66.76,14.8 0 bottom
JP1078  [1X01_SMD_3.25X0.85MM_NO_SILK]  66.76,13.53 0 bottom
JP1079  [1X01_SMD_3.25X0.85MM_NO_SILK]  66.76,12.26 0 bottom
JP1080  [1X01_SMD_3.25X0.85MM_NO_SILK]  66.76,10.99 0 bottom
JP1081  [1X01_SMD_3.25X0.85MM_NO_SILK]  72.03,85.92 0 bottom
JP1082  [1X01_SMD_3.25X0.85MM_NO_SILK]  72.03,84.65 0 bottom
JP1083  [1X01_SMD_3.25X0.85MM_NO_SILK]  72.03,83.38 0 bottom
JP1084  [1X01_SMD_3.25X0.85MM_NO_SILK]  72.03,82.11 0 bottom
JP1085  [1X01_SMD_3.25X0.85MM_NO_SILK]  72.03,80.84 0 bottom
JP1086  [1X01_SMD_3.25X0.85MM_NO_SILK]  72.03,79.57 0 bottom
JP1087  [1X01_SMD_3.25X0.85MM_NO_SILK]  72.03,78.3 0 bottom
JP1088  [1X01_SMD_3.25X0.85MM_NO_SILK]  72.03,77.03 0 bottom
JP1089  [1X01_SMD_3.25X0.85MM_NO_SILK]  72.03,75.76 0 bottom
JP1090  [1X01_SMD_3.25X0.85MM_NO_SILK]  72.03,74.49 0 bottom
JP1091  [1X01_SMD_3.25X0.85MM_NO_SILK]  72.03,73.22 0 bottom
JP1092  [1X01_SMD_3.25X0.85MM_NO_SILK]  72.03,71.95 0 bottom
JP1093  [1X01_SMD_3.25X0.85MM_NO_SILK]  72.03,70.68 0 bottom
JP1094  [1X01_SMD_3.25X0.85MM_NO_SILK]  72.03,69.41 0 bottom
JP1095  [1X01_SMD_3.25X0.85MM_NO_SILK]  72.03,68.14 0 bottom
JP1096  [1X01_SMD_3.25X0.85MM_NO_SILK]  72.03,66.87 0 bottom
JP1097  [1X01_SMD_3.25X0.85MM_NO_SILK]  72.03,65.6 0 bottom
JP1098  [1X01_SMD_3.25X0.85MM_NO_SILK]  72.03,64.33 0 bottom
JP1099  [1X01_SMD_3.25X0.85MM_NO_SILK]  72.03,63.06 0 bottom
JP1100  [1X01_SMD_3.25X0.85MM_NO_SILK]  72.03,61.79 0 bottom
JP1101  [1X01_SMD_3.25X0.85MM_NO_SILK]  72.03,60.52 0 bottom
JP1102  [1X01_SMD_3.25X0.85MM_NO_SILK]  72.03,59.25 0 bottom
JP1103  [1X01_SMD_3.25X0.85MM_NO_SILK]  72.03,57.98 0 bottom
JP1104  [1X01_SMD_3.25X0.85MM_NO_SILK]  72.03,56.71 0 bottom
JP1105  [1X01_SMD_3.25X0.85MM_NO_SILK]  72.03,55.44 0 bottom
JP1106  [1X01_SMD_3.25X0.85MM_NO_SILK]  72.03,54.17 0 bottom
JP1107  [1X01_SMD_3.25X0.85MM_NO_SILK]  72.03,52.9 0 bottom
JP1108  [1X01_SMD_3.25X0.85MM_NO_SILK]  72.03,51.63 0 bottom
JP1109  [1X01_SMD_3.25X0.85MM_NO_SILK]  72.03,50.36 0 bottom
JP1110  [1X01_SMD_3.25X0.85MM_NO_SILK]  72.03,49.09 0 bottom
JP1111  [1X01_SMD_3.25X0.85MM_NO_SILK]  72.03,47.82 0 bottom
JP1112  [1X01_SMD_3.25X0.85MM_NO_SILK]  72.03,46.55 0 bottom
JP1113  [1X01_SMD_3.25X0.85MM_NO_SILK]  72.03,45.28 0 bottom
JP1114  [1X01_SMD_3.25X0.85MM_NO_SILK]  72.03,44.01 0 bottom
JP1115  [1X01_SMD_3.25X0.85MM_NO_SILK]  72.03,42.74 0 bottom
JP1116  [1X01_SMD_3.25X0.85MM_NO_SILK]  72.03,41.47 0 bottom
JP1117  [1X01_SMD_3.25X0.85MM_NO_SILK]  72.03,40.2 0 bottom
JP1118  [1X01_SMD_3.25X0.85MM_NO_SILK]  72.03,38.93 0 bottom
JP1119  [1X01_SMD_3.25X0.85MM_NO_SILK]  72.03,37.66 0 bottom
JP1120  [1X01_SMD_3.25X0.85MM_NO_SILK]  72.03,36.39 0 bottom
JP1121  [1X01_SMD_3.25X0.85MM_NO_SILK]  72.03,35.12 0 bottom
JP1122  [1X01_SMD_3.25X0.85MM_NO_SILK]  72.03,33.85 0 bottom
JP1123  [1X01_SMD_3.25X0.85MM_NO_SILK]  72.03,32.58 0 bottom
JP1124  [1X01_SMD_3.25X0.85MM_NO_SILK]  72.03,31.31 0 bottom
JP1125  [1X01_SMD_3.25X0.85MM_NO_SILK]  72.03,30.04 0 bottom
JP1126  [1X01_SMD_3.25X0.85MM_NO_SILK]  72.03,28.77 0 bottom
JP1127  [1X01_SMD_3.25X0.85MM_NO_SILK]  72.03,27.5 0 bottom
JP1128  [1X01_SMD_3.25X0.85MM_NO_SILK]  72.03,26.23 0 bottom
JP1129  [1X01_SMD_3.25X0.85MM_NO_SILK]  72.03,24.96 0 bottom
JP1130  [1X01_SMD_3.25X0.85MM_NO_SILK]  72.03,23.69 0 bottom
JP1131  [1X01_SMD_3.25X0.85MM_NO_SILK]  72.03,22.42 0 bottom
JP1132  [1X01_SMD_3.25X0.85MM_NO_SILK]  72.03,21.15 0 bottom
JP1133  [1X01_SMD_3.25X0.85MM_NO_SILK]  72.03,19.88 0 bottom
JP1134  [1X01_SMD_3.25X0.85MM_NO_SILK]  72.03,18.61 0 bottom
JP1135  [1X01_SMD_3.25X0.85MM_NO_SILK]  72.03,17.34 0 bottom
JP1136  [1X01_SMD_3.25X0.85MM_NO_SILK]  72.03,16.07 0 bottom
JP1137  [1X01_SMD_3.25X0.85MM_NO_SILK]  72.03,14.8 0 bottom
JP1138  [1X01_SMD_3.25X0.85MM_NO_SILK]  72.03,13.53 0 bottom
JP1139  [1X01_SMD_3.25X0.85MM_NO_SILK]  72.03,12.26 0 bottom
JP1140  [1X01_SMD_3.25X0.85MM_NO_SILK]  72.03,10.99 0 bottom
JP1141  [1X01_SMD_3.25X0.85MM_NO_SILK]  24.32,95.2 270 bottom
JP1142  [1X01_SMD_3.25X0.85MM_NO_SILK]  25.59,95.2 270 bottom
JP1143  [1X01_SMD_3.25X0.85MM_NO_SILK]  26.86,95.2 270 bottom
JP1144  [1X01_SMD_3.25X0.85MM_NO_SILK]  28.13,95.2 270 bottom
JP1145  [1X01_SMD_3.25X0.85MM_NO_SILK]  29.4,95.2 270 bottom
JP1146  [1X01_SMD_3.25X0.85MM_NO_SILK]  30.67,95.2 270 bottom
JP1147  [1X01_SMD_3.25X0.85MM_NO_SILK]  31.94,95.2 270 bottom
JP1148  [1X01_SMD_3.25X0.85MM_NO_SILK]  33.21,95.2 270 bottom
JP1149  [1X01_SMD_3.25X0.85MM_NO_SILK]  34.48,95.2 270 bottom
JP1150  [1X01_SMD_3.25X0.85MM_NO_SILK]  35.75,95.2 270 bottom
JP1151  [1X01_SMD_3.25X0.85MM_NO_SILK]  24.32,91.01 270 bottom
JP1152  [1X01_SMD_3.25X0.85MM_NO_SILK]  25.59,91.01 270 bottom
JP1153  [1X01_SMD_3.25X0.85MM_NO_SILK]  26.86,91.01 270 bottom
JP1154  [1X01_SMD_3.25X0.85MM_NO_SILK]  28.13,91.01 270 bottom
JP1155  [1X01_SMD_3.25X0.85MM_NO_SILK]  29.4,91.01 270 bottom
JP1156  [1X01_SMD_3.25X0.85MM_NO_SILK]  30.67,91.01 270 bottom
JP1157  [1X01_SMD_3.25X0.85MM_NO_SILK]  31.94,91.01 270 bottom
JP1158  [1X01_SMD_3.25X0.85MM_NO_SILK]  33.21,91.01 270 bottom
JP1159  [1X01_SMD_3.25X0.85MM_NO_SILK]  34.48,91.01 270 bottom
JP1160  [1X01_SMD_3.25X0.85MM_NO_SILK]  35.75,91.01 270 bottom
JP1161  [1X01_SMD_3.25X0.85MM_NO_SILK]  44.76,95.2 270 bottom
JP1162  [1X01_SMD_3.25X0.85MM_NO_SILK]  46.03,95.2 270 bottom
JP1163  [1X01_SMD_3.25X0.85MM_NO_SILK]  47.3,95.2 270 bottom
JP1164  [1X01_SMD_3.25X0.85MM_NO_SILK]  48.57,95.2 270 bottom
JP1165  [1X01_SMD_3.25X0.85MM_NO_SILK]  49.84,95.2 270 bottom
JP1166  [1X01_SMD_3.25X0.85MM_NO_SILK]  51.11,95.2 270 bottom
JP1167  [1X01_SMD_3.25X0.85MM_NO_SILK]  52.38,95.2 270 bottom
JP1168  [1X01_SMD_3.25X0.85MM_NO_SILK]  53.65,95.2 270 bottom
JP1169  [1X01_SMD_3.25X0.85MM_NO_SILK]  54.92,95.2 270 bottom
JP1170  [1X01_SMD_3.25X0.85MM_NO_SILK]  56.19,95.2 270 bottom
JP1171  [1X01_SMD_3.25X0.85MM_NO_SILK]  44.76,91.01 270 bottom
JP1172  [1X01_SMD_3.25X0.85MM_NO_SILK]  46.03,91.01 270 bottom
JP1173  [1X01_SMD_3.25X0.85MM_NO_SILK]  47.3,91.01 270 bottom
JP1174  [1X01_SMD_3.25X0.85MM_NO_SILK]  48.57,91.01 270 bottom
JP1175  [1X01_SMD_3.25X0.85MM_NO_SILK]  49.84,91.01 270 bottom
JP1176  [1X01_SMD_3.25X0.85MM_NO_SILK]  51.11,91.01 270 bottom
JP1177  [1X01_SMD_3.25X0.85MM_NO_SILK]  52.38,91.01 270 bottom
JP1178  [1X01_SMD_3.25X0.85MM_NO_SILK]  53.65,91.01 270 bottom
JP1179  [1X01_SMD_3.25X0.85MM_NO_SILK]  54.92,91.01 270 bottom
JP1180  [1X01_SMD_3.25X0.85MM_NO_SILK]  56.19,91.01 270 bottom
JP1181  [1X01_SMD_3.25X0.85MM_NO_SILK]  24.32,5.92 270 bottom
JP1182  [1X01_SMD_3.25X0.85MM_NO_SILK]  25.59,5.92 270 bottom
JP1183  [1X01_SMD_3.25X0.85MM_NO_SILK]  26.86,5.92 270 bottom
JP1184  [1X01_SMD_3.25X0.85MM_NO_SILK]  28.13,5.92 270 bottom
JP1185  [1X01_SMD_3.25X0.85MM_NO_SILK]  29.4,5.92 270 bottom
JP1186  [1X01_SMD_3.25X0.85MM_NO_SILK]  30.67,5.92 270 bottom
JP1187  [1X01_SMD_3.25X0.85MM_NO_SILK]  31.94,5.92 270 bottom
JP1188  [1X01_SMD_3.25X0.85MM_NO_SILK]  33.21,5.92 270 bottom
JP1189  [1X01_SMD_3.25X0.85MM_NO_SILK]  34.48,5.92 270 bottom
JP1190  [1X01_SMD_3.25X0.85MM_NO_SILK]  35.75,5.92 270 bottom
JP1191  [1X01_SMD_3.25X0.85MM_NO_SILK]  44.64,5.92 270 bottom
JP1192  [1X01_SMD_3.25X0.85MM_NO_SILK]  45.91,5.92 270 bottom
JP1193  [1X01_SMD_3.25X0.85MM_NO_SILK]  47.18,5.92 270 bottom
JP1194  [1X01_SMD_3.25X0.85MM_NO_SILK]  48.45,5.92 270 bottom
JP1195  [1X01_SMD_3.25X0.85MM_NO_SILK]  49.72,5.92 270 bottom
JP1196  [1X01_SMD_3.25X0.85MM_NO_SILK]  50.99,5.92 270 bottom
JP1197  [1X01_SMD_3.25X0.85MM_NO_SILK]  52.26,5.92 270 bottom
JP1198  [1X01_SMD_3.25X0.85MM_NO_SILK]  53.53,5.92 270 bottom
JP1199  [1X01_SMD_3.25X0.85MM_NO_SILK]  54.8,5.92 270 bottom
JP1200  [1X01_SMD_3.25X0.85MM_NO_SILK]  56.07,5.92 270 bottom

## Tracks (layer width: path | path; a pad name or v marks a point on that pad's centre or on a via)
0_1440127218
  Bottom 0.152: JP961.P$1 13.26,85.8 17.37,85.8 18.75,84.43 24.08,84.43 24.99,85.34 JP1.1
0_1440127248
  Bottom 0.152: JP1021.P$1 66.75,85.8 65.08,85.8 60.81,81.53 59.44,81.53 55.63,85.34 JP10.1
0_1440127317
  Bottom 0.152: JP1141.P$1 24.23,95.1 24.23,93.88 21.95,91.59 21.95,90.53 24.84,87.63 33.07,87.63 35.2,85.5 JP5.1
0_1440127347
  Bottom 0.152: JP1142.P$1 25.45,95.1 25.45,93.88 24.54,92.96 23.77,92.96 22.25,91.44 22.25,90.68 24.99,87.94 33.83,87.94 35.05,86.72 35.66,86.72 36.42,85.95 36.42,84.12 35.36,83.06 JP15.1
0_1440127366  (via drill 0.3)
  Top 0.152: v38.56,92.66 v38.56,97.08
  Bottom 0.152: v38.56,97.08 37.34,98.3 28.8,98.3 26.98,96.47 26.98,95.25 JP1143.P$1 | v38.56,92.66 38.56,92.35 39.78,91.14 39.78,81.23 39.01,80.47 35.36,80.47 JP25.1
0_1440127382
  Bottom 0.152: JP1144.P$1 28.19,95.25 28.19,96.47 29.72,97.99 36.88,97.99 39.32,95.56 39.32,92.05 40.08,91.29 40.08,81.08 38.86,79.86 37.34,79.86 35.36,77.88 JP35.1
0_1440127392  (via drill 0.3)
  Top 0.152: v36.73,97.38 36.73,76.5 35.66,75.44 35.36,75.44 JP45.1
  Bottom 0.152: v36.73,97.38 30.48,97.38 29.41,96.32 29.41,95.25 JP1145.P$1
0_1440127421  (via drill 0.3)
  Top 0.152: v37.34,96.01 37.34,90.98 37.03,90.68 37.03,74.52 35.36,72.85 JP55.1
  Bottom 0.152: v37.34,96.01 36.27,97.08 31.39,97.08 30.79,96.47 30.79,95.25 JP1146.P$1
0_1440127430  (via drill 0.3)
  Top 0.152: v38.86,90.83 38.86,87.17 40.69,85.34 v40.69,81.23 | v39.17,76.05 39.17,74.07 35.36,70.26 JP65.1
  Bottom 0.152: v38.86,90.83 36.42,93.27 32.77,93.27 32,94.03 32,95.1 JP1147.P$1 | v40.69,81.23 40.69,77.57 v39.17,76.05
0_1440127608  (1 unrouted)
0_1440127617  (1 unrouted)
0_1440127627  (via drill 0.3)
  Top 0.152: v39.17,86.11 40.08,85.19 40.08,81.08 42.06,79.1 42.06,76.35 42.22,76.2 v42.22,75.29 | v37.64,56.84 35.66,58.83 34.75,58.83 33.98,59.59 33.98,61.27 35.2,62.48 JP95.1
  Bottom 0.152: v39.17,86.11 39.47,86.41 39.47,90.98 35.81,94.64 35.81,95.1 JP1150.P$1 | v42.22,75.29 42.22,61.42 v37.64,56.84
0_1440127700  (via drill 0.3)
  Top 0.152: v22.86,90.98 16.61,90.98 1.22,75.59 1.22,18.29 18.14,1.37 31.39,1.37 39.47,9.45 39.47,33.83 v39.17,34.14 | v38.41,56.69 38.41,57 35.36,60.05 JP105.1
  Bottom 0.152: v22.86,90.98 24.23,90.98 JP1151.P$1 | v39.17,34.14 39.17,35.2 38.41,35.97 v38.41,56.69
0_1440127712  (1 unrouted)
0_1440127720  (1 unrouted)
0_1440127729  (1 unrouted)
0_1440127744  (1 unrouted)
0_1440127816  (1 unrouted)
0_1440127828  (1 unrouted)
0_1440127838  (via drill 0.3)
  Top 0.152: v39.17,85.34 39.17,81.53 41.15,79.55 v41.15,77.27 | v36.42,56.39 36.42,43.43 35.36,42.37 JP175.1
  Bottom 0.152: v39.17,85.34 35.81,88.7 34.29,88.7 33.22,89.76 33.22,90.98 JP1158.P$1 | v41.15,77.27 41.15,76.35 39.47,74.68 39.47,59.44 v36.42,56.39
0_1440127850  (1 unrouted)
0_1440127870  (1 unrouted)
0_1440127904
  Bottom 0.152: JP1181.P$1 24.38,5.94 24.38,7.16 26.06,8.84 30.63,8.84 32.31,10.52 33.98,10.52 35.2,11.73 JP295.1
0_1440127914  (via drill 0.3)
  Top 0.152: v24.69,3.81 17.22,3.81 v16.31,4.72
  Bottom 0.152: v24.69,3.81 25.45,4.57 25.45,5.79 JP1182.P$1 | v16.31,4.72 20.27,4.72 24.99,9.45 29.57,9.45 31.39,11.28 31.39,12.19 32.31,13.11 33.98,13.11 35.2,14.33 JP285.1
0_1440127944  (via drill 0.3)
  Top 0.152: v26.36,3.81 26.06,3.81 23.77,6.1 v19.96,6.1
  Bottom 0.152: v26.36,3.81 26.82,4.27 26.82,5.79 JP1183.P$1 | v19.96,6.1 20.27,6.1 24.69,10.52 25.45,10.52 26.36,11.43 26.36,12.34 27.13,13.11 28.04,13.11 28.96,14.02 28.96,14.94 29.72,15.7 34.14,15.7 35.2,16.76 JP275.1
0_1440127955  (via drill 0.3)
  Top 0.152: v28.19,3.81 28.5,3.81 29.41,2.9 32.16,2.9 v37.19,7.92
  Bottom 0.152: v28.19,3.81 28.19,5.79 JP1184.P$1 | v37.19,7.92 37.19,15.54 37.34,15.7 37.34,17.37 35.36,19.36 JP265.1
0_1440128006
  Bottom 0.152: JP1185.P$1 29.41,5.94 29.41,7.16 32.46,10.21 35.36,10.21 36.42,11.28 36.42,15.39 36.12,15.7 36.12,16 36.42,16.31 36.42,17.37 35.66,18.14 34.75,18.14 33.98,18.9 33.98,20.73 35.2,21.95 JP255.1
0_1440128015  (via drill 0.3)
  Top 0.152: v29.72,3.81 29.41,3.81 25.91,7.32 18.14,7.32 v17.83,7.01 | v17.22,8.53 17.53,8.53 17.83,8.23 30.18,8.23 31.55,9.6 35.66,9.6 38.25,12.19 v38.25,21.49
  Bottom 0.152: v29.72,3.81 30.63,4.72 30.63,5.79 JP1186.P$1 | v17.83,7.01 17.83,7.92 v17.22,8.53 | v38.25,21.49 35.36,24.38 JP245.1
0_1440128025  (via drill 0.3)
  Top 0.152: v36.73,15.85 36.73,16.15 36.88,16.31 36.88,25.45 35.36,26.98 JP235.1
  Bottom 0.152: v36.73,15.85 36.73,11.12 35.51,9.91 34.59,9.91 32,7.32 32,5.94 JP1187.P$1
0_1440128039  (via drill 0.3)
  Top 0.152: v32.31,3.81 30.48,3.81 29.87,3.2 29.57,3.2 26.06,6.71 v18.59,6.71 | v17.98,8.84 18.29,8.84 18.59,8.53 30.02,8.53 31.39,9.91 35.51,9.91 37.64,12.04 37.64,26.82 v37.95,27.13
  Bottom 0.152: v32.31,3.81 33.07,4.57 33.07,5.79 JP1188.P$1 | v18.59,6.71 18.59,8.23 v17.98,8.84 | v37.95,27.13 35.36,29.72 JP225.1
0_1440128052  (via drill 0.3)
  Top 0.152: v33.53,8.08 30.94,8.08 30.48,7.62 16.46,7.62 2.44,21.64 2.44,21.95 2.9,22.4 7.16,22.4 16.92,12.65 20.27,12.65 22.55,10.36 22.55,10.06 23.47,9.14 29.72,9.14 31.09,10.52 33.07,10.52 33.98,11.43 33.98,12.34 34.75,13.11 35.66,13.11 36.42,13.87 36.42,15.39 36.12,15.7 36.12,16 36.58,16.46 36.58,24.84 35.66,25.76 34.75,25.76 33.98,26.52 33.98,30.79 35.2,32 JP215.1
  Bottom 0.152: v33.53,8.08 34.44,7.16 34.44,5.94 JP1189.P$1
0_1440128062  (via drill 0.3)
  Top 0.152: v35.81,8.69 39.17,12.04 39.17,30.33 v38.25,31.24
  Bottom 0.152: v35.81,8.69 35.81,5.94 JP1190.P$1 | v38.25,31.24 38.25,31.7 35.36,34.59 JP205.1
0_1440128088
  Bottom 0.152: JP1170.P$1 56.24,95.1 56.24,94.49 58.83,91.9 58.83,90.37 56.08,87.63 47.55,87.63 45.41,85.5 JP6.1
0_1440128098
  Bottom 0.152: JP1169.P$1 54.86,95.1 54.86,94.03 53.8,92.96 44.35,92.96 41.15,89.76 41.15,83.52 41.6,83.06 45.26,83.06 JP16.1
0_1440128106  (via drill 0.3)
  Top 0.152: v53.8,97.38 53.8,96.16 v57.91,92.05 | v47.09,81.69 48.31,81.69 49.23,80.77 49.23,80.01 48.31,79.1 47.09,79.1 v46.94,78.94
  Bottom 0.152: v53.8,97.38 53.8,95.25 JP1168.P$1 | v57.91,92.05 58.52,91.44 58.52,90.53 55.93,87.94 46.33,87.94 45.11,86.72 44.96,86.72 44.2,85.95 44.2,84.89 44.96,84.12 45.87,84.12 46.63,83.36 46.63,82.14 v47.09,81.69 | v46.94,78.94 45.41,80.47 JP26.1
0_1440128116  (via drill 0.3)
  Top 0.152: v46.63,97.99 42.06,93.42 42.06,84.58 42.67,83.97 42.67,80.92 v42.37,80.62
  Bottom 0.152: v46.63,97.99 50.75,97.99 52.27,96.47 52.27,95.25 JP1167.P$1 | v42.37,80.62 45.26,77.72 JP36.1
0_1440128126  (via drill 0.3)
  Top 0.152: v50.29,97.38 49.68,97.99 48.62,97.99 v43.28,92.66
  Bottom 0.152: v50.29,97.38 51.05,96.62 51.05,95.25 JP1166.P$1 | v43.28,92.66 43.28,92.35 40.69,89.76 40.69,81.99 41.76,80.92 41.76,78.94 45.26,75.44 JP46.1
0_1440128135  (via drill 0.3)
  Top 0.152: v49.53,97.38 49.53,94.64 v43.89,89 | v44.35,87.94 44.35,86.11 44.2,85.95 44.2,77.27 44.96,76.5 45.87,76.5 46.63,75.74 46.63,74.22 45.26,72.85 JP56.1
  Bottom 0.152: v49.53,97.38 49.84,97.08 49.84,95.25 JP1165.P$1 | v43.89,89 43.89,88.39 v44.35,87.94
0_1440128149  (via drill 0.3)
  Top 0.152: v48.77,97.38 48.77,94.64 42.82,88.7 42.82,86.11 43.59,85.34 43.59,76.2 43.89,75.89 43.89,74.22 v43.59,73.91
  Bottom 0.152: v48.77,97.38 48.62,97.23 48.62,95.25 JP1164.P$1 | v43.59,73.91 42.98,73.3 42.98,72.54 45.26,70.26 JP66.1
0_1440128159  (via drill 0.3)
  Top 0.152: v42.67,93.27 42.67,89 42.37,88.7 42.37,84.73 42.98,84.12 42.98,79.1 v42.67,78.79 | v46.94,73.76 46.94,73.46 46.63,73.15 46.63,69.04 45.41,67.82 JP76.1
  Bottom 0.152: v42.67,93.27 46.48,93.27 47.24,94.03 47.24,95.1 JP1163.P$1 | v42.67,78.79 44.96,76.5 45.87,76.5 46.63,75.74 46.63,74.07 v46.94,73.76
0_1440128167  (1 unrouted)
0_1440128175  (1 unrouted)
0_1440128223  (1 unrouted)
0_1440128233  (1 unrouted)
0_1440128243  (1 unrouted)
0_1440128252  (1 unrouted)
0_1440128264  (1 unrouted)
0_1440128275  (1 unrouted)
0_1440128290  (1 unrouted)
0_1440128302  (via drill 0.3)
  Top 0.152: v43.74,86.72 43.74,85.65 43.89,85.5 43.89,76.35 44.2,76.05 44.2,62.18 41.3,59.28 41.3,58.52 41.6,58.22 41.6,47.7 42.52,46.79 42.52,45.41 v42.37,45.26
  Bottom 0.152: v43.74,86.72 44.35,87.33 44.81,87.33 47.24,89.76 47.24,90.98 JP1173.P$1 | v42.37,45.26 45.26,42.37 JP176.1
0_1440128314  (1 unrouted)
0_1440128326  (1 unrouted)
0_1440128344
  Bottom 0.152: JP1200.P$1 55.93,5.94 55.93,7.16 52.88,10.21 49.53,10.21 49.23,10.52 46.63,10.52 45.41,11.73 JP296.1
0_1440128353
  Bottom 0.152: JP1199.P$1 54.71,5.79 54.71,4.72 52.12,2.13 49.38,2.13 48.31,3.2 47.09,3.2 46.33,3.96 44.2,3.96 43.89,4.27 43.89,12.95 45.26,14.33 JP286.1
0_1440128363  (via drill 0.3)
  Top 0.152: v52.43,8.23 46.79,8.23 43.89,11.12 43.89,15.7 44.96,16.76 45.26,16.76 JP276.1
  Bottom 0.152: v52.43,8.23 53.49,7.16 53.49,5.94 JP1198.P$1
0_1440128375
  Bottom 0.152: JP1197.P$1 52.12,5.94 52.12,7.16 49.07,10.21 45.26,10.21 44.2,11.28 44.2,12.34 44.96,13.11 45.87,13.11 46.63,13.87 46.63,18.14 45.41,19.36 JP266.1
0_1440128386  (via drill 0.3)
  Top 0.152: v50.14,2.74 49.38,2.74 48.01,1.37 46.94,1.37 40.84,7.47 40.84,37.64 v41.6,38.41
  Bottom 0.152: v50.14,2.74 50.9,3.5 50.9,5.79 JP1196.P$1 | v41.6,38.41 41.6,38.1 41.3,37.8 41.3,26.06 45.26,22.1 JP256.1
0_1440128396  (via drill 0.3)
  Top 0.152: v49.68,3.81 53.03,3.81 v57.45,8.23 | v56.54,9.91 50.6,9.91 49.23,11.28 49.23,15.09 v49.53,15.39 | v51.66,18.29 v51.66,16
  Bottom 0.152: v49.68,3.81 49.68,5.79 JP1195.P$1 | v57.45,8.23 57.45,8.99 v56.54,9.91 | v49.53,15.39 49.84,15.39 50.14,15.7 51.36,15.7 v51.66,16 | v51.66,18.29 51.66,19.96 50.9,20.73 49.99,20.73 49.23,21.49 49.23,22.4 48.31,23.32 46.48,23.32 45.41,24.38 JP246.1
0_1440128405  (via drill 0.3)
  Top 0.152: v48.16,3.81 48.16,4.12 42.98,9.3 42.98,19.66 43.59,20.27 43.59,25.3 45.26,26.98 JP236.1
  Bottom 0.152: v48.16,3.81 48.31,3.96 48.31,5.79 JP1194.P$1
0_1440128414  (via drill 0.3)
  Top 0.152: v47.24,3.81 47.24,4.57 42.67,9.14 42.67,19.81 43.28,20.42 43.28,27.58 45.26,29.57 JP226.1
  Bottom 0.152: v47.24,3.81 47.24,5.79 JP1193.P$1
0_1440128424  (1 unrouted)
0_1440128432  (via drill 0.3)
  Top 0.152: v44.5,9.3 44.5,9.6 43.28,10.82 43.28,19.51 43.89,20.12 43.89,24.69 44.96,25.76 45.87,25.76 46.63,26.52 46.63,30.33 v47.09,30.79
  Bottom 0.152: v44.5,9.3 44.5,5.94 JP1191.P$1 | v47.09,30.79 48.31,30.79 49.23,31.7 49.23,35.05 48.31,35.97 46.63,35.97 45.41,34.75 JP206.1
1_1440127218
  Bottom 0.152: JP963.P$1 13.26,83.36 23.01,83.36 23.47,82.91 24.99,82.91 JP11.1
1_1440127248  (via drill 0.3)
  Top 0.152: v63.86,83.36 55.93,83.36 55.63,83.06 JP20.1
  Bottom 0.152: v63.86,83.36 66.75,83.36 JP1023.P$1
2_1440127218
  Bottom 0.152: JP965.P$1 13.26,80.77 24.69,80.77 24.99,80.47 JP21.1
2_1440127248
  Bottom 0.152: JP1025.P$1 66.75,80.77 55.93,80.77 55.63,80.47 JP30.1
3_1440127218
  Bottom 0.152: JP967.P$1 13.26,78.18 24.69,78.18 24.99,77.88 JP31.1
3_1440127248
  Bottom 0.152: JP1027.P$1 66.75,78.18 55.93,78.18 55.63,77.88 JP40.1
4_1440127218
  Bottom 0.152: JP969.P$1 13.26,75.74 24.69,75.74 24.99,75.44 JP41.1
4_1440127248
  Bottom 0.152: JP1029.P$1 66.75,75.74 55.93,75.74 55.63,75.44 JP50.1
5_1440127218
  Bottom 0.152: JP971.P$1 13.26,73.15 24.69,73.15 24.99,72.85 JP51.1
5_1440127248
  Bottom 0.152: JP1031.P$1 66.75,73.15 55.93,73.15 55.63,72.85 JP60.1
6_1440127218
  Bottom 0.152: JP973.P$1 13.26,70.56 24.69,70.56 24.99,70.26 JP61.1
6_1440127248
  Bottom 0.152: JP1033.P$1 66.75,70.56 55.93,70.56 55.63,70.26 JP70.1
7_1440127218
  Bottom 0.152: JP975.P$1 13.26,68.12 24.69,68.12 24.99,67.82 JP71.1
7_1440127248
  Bottom 0.152: JP1035.P$1 66.75,68.12 55.93,68.12 55.63,67.82 JP80.1
8_1440127218
  Bottom 0.152: JP977.P$1 13.26,65.53 24.69,65.53 24.99,65.23 JP81.1
8_1440127248
  Bottom 0.152: JP1037.P$1 66.75,65.53 55.93,65.53 55.63,65.23 JP90.1
9_1440127218
  Bottom 0.152: JP979.P$1 13.26,62.94 24.69,62.94 24.99,62.64 JP91.1
9_1440127248
  Bottom 0.152: JP1039.P$1 66.75,62.94 55.93,62.94 55.63,62.64 JP100.1
10_1440127218
  Bottom 0.152: JP981.P$1 13.26,60.5 24.69,60.5 24.99,60.2 JP101.1
10_1440127248
  Bottom 0.152: JP1041.P$1 66.75,60.5 55.93,60.5 55.63,60.2 JP110.1
11_1440127218
  Bottom 0.152: JP983.P$1 13.26,57.91 24.69,57.91 24.99,57.61 JP111.1
11_1440127248
  Bottom 0.152: JP1043.P$1 66.75,57.91 55.93,57.91 55.63,57.61 JP120.1
12_1440127218
  Bottom 0.152: JP985.P$1 13.26,55.32 24.69,55.32 24.99,55.02 JP121.1
12_1440127248
  Bottom 0.152: JP1045.P$1 66.75,55.32 55.93,55.32 55.63,55.02 JP130.1
13_1440127218
  Bottom 0.152: JP987.P$1 13.26,52.88 24.69,52.88 24.99,52.58 JP131.1
13_1440127248
  Bottom 0.152: JP1047.P$1 66.75,52.88 55.93,52.88 55.63,52.58 JP140.1
14_1440127218
  Bottom 0.152: JP989.P$1 13.26,50.29 24.69,50.29 24.99,49.99 JP141.1
14_1440127248
  Bottom 0.152: JP1049.P$1 66.75,50.29 55.93,50.29 55.63,49.99 JP150.1
15_1440127218
  Bottom 0.152: JP991.P$1 13.26,47.7 24.69,47.7 24.99,47.4 JP151.1
15_1440127248
  Bottom 0.152: JP1051.P$1 66.75,47.7 55.93,47.7 55.63,47.4 JP160.1
16_1440127218
  Bottom 0.152: JP993.P$1 13.26,45.26 24.69,45.26 24.99,44.96 JP161.1
16_1440127248
  Bottom 0.152: JP1053.P$1 66.75,45.26 57,45.26 56.69,44.96 55.63,44.96 JP170.1
17_1440127218
  Bottom 0.152: JP995.P$1 13.26,42.67 21.49,42.67 21.79,42.37 24.99,42.37 JP171.1
17_1440127248
  Bottom 0.152: JP1055.P$1 66.75,42.67 55.93,42.67 55.63,42.37 JP180.1
18_1440127218
  Bottom 0.152: JP997.P$1 13.26,40.08 24.69,40.08 24.99,39.78 JP181.1
18_1440127248
  Bottom 0.152: JP1057.P$1 66.75,40.08 55.93,40.08 55.63,39.78 JP190.1
19_1440127218
  Bottom 0.152: JP999.P$1 13.26,37.64 24.69,37.64 24.99,37.34 JP191.1
19_1440127248
  Bottom 0.152: JP1059.P$1 66.75,37.64 57,37.64 56.69,37.34 55.63,37.34 JP200.1
20_1440127218
  Bottom 0.152: JP1001.P$1 13.26,35.2 17.68,35.2 19.2,36.73 23.01,36.73 24.99,34.75 JP201.1
20_1440127248
  Bottom 0.152: JP1061.P$1 66.75,35.05 55.93,35.05 55.63,34.75 JP210.1
21_1440127218
  Bottom 0.152: JP1003.P$1 13.26,32.46 24.69,32.46 24.99,32.16 JP211.1
21_1440127248
  Bottom 0.152: JP1063.P$1 66.75,32.46 55.93,32.46 55.63,32.16 JP220.1
22_1440127218
  Bottom 0.152: JP1005.P$1 13.26,30.02 24.69,30.02 24.99,29.72 JP221.1
22_1440127248
  Bottom 0.152: JP1065.P$1 66.75,30.02 55.93,30.02 55.63,29.72 JP230.1
23_1440127218
  Bottom 0.152: JP1007.P$1 13.26,27.43 24.69,27.43 24.99,27.13 JP231.1
23_1440127248
  Bottom 0.152: JP1067.P$1 66.75,27.43 58.52,27.43 58.06,26.98 55.63,26.98 JP240.1
24_1440127218
  Bottom 0.152: JP1009.P$1 13.26,24.84 24.69,24.84 24.99,24.54 JP241.1
24_1440127248
  Bottom 0.152: JP1069.P$1 66.75,24.84 55.93,24.84 55.63,24.54 JP250.1
25_1440127218
  Bottom 0.152: JP1011.P$1 13.26,22.4 24.69,22.4 24.99,22.1 JP251.1
25_1440127248
  Bottom 0.152: JP1071.P$1 66.75,22.4 55.93,22.4 55.63,22.1 JP260.1
26_1440127218
  Bottom 0.152: JP1013.P$1 13.26,19.81 24.69,19.81 24.99,19.51 JP261.1
26_1440127248
  Bottom 0.152: JP1073.P$1 66.75,19.81 55.93,19.81 55.63,19.51 JP270.1
27_1440127218
  Bottom 0.152: JP1015.P$1 13.26,17.22 24.69,17.22 24.99,16.92 JP271.1
27_1440127248
  Bottom 0.152: JP1075.P$1 66.75,17.22 55.93,17.22 55.63,16.92 JP280.1
28_1440127218
  Bottom 0.152: JP1017.P$1 13.26,14.78 24.69,14.78 24.99,14.48 JP281.1
28_1440127248
  Bottom 0.152: JP1077.P$1 66.75,14.78 55.93,14.78 55.63,14.48 JP290.1
29_1440127218
  Bottom 0.152: JP1019.P$1 13.26,12.34 18.44,12.34 18.75,12.65 24.23,12.65 24.99,11.89 JP291.1
29_1440127248
  Bottom 0.152: JP1079.P$1 66.75,12.34 61.57,12.34 61.27,12.65 56.39,12.65 55.63,11.89 JP300.1
30_1440127218
  Bottom 0.152: JP1020.P$1 13.26,10.97 17.22,7.01 17.22,6.86 18.59,5.49 20.12,5.49 24.84,10.21 26.06,10.21 27.58,11.73 JP292.1
30_1440127248
  Bottom 0.152: JP1080.P$1 66.75,10.97 63.4,10.97 60.05,7.62 57.3,7.62 53.03,11.89 JP299.1
31_1440127218  (via drill 0.3)
  Top 0.152: v17.83,84.58 18.75,84.58 18.9,84.43 22.25,84.43 24.54,86.72 26.36,86.72 27.58,85.5 JP2.1
  Bottom 0.152: v17.83,84.58 13.26,84.58 JP962.P$1
31_1440127248
  Bottom 0.152: JP1022.P$1 66.75,84.58 64.31,84.58 60.96,81.23 58.98,81.23 55.93,84.28 54.1,84.28 53.03,85.34 JP9.1
32_1440127218  (via drill 0.3)
  Top 0.152: v20.88,82.75 22.1,82.75 23.47,84.12 26.52,84.12 27.58,83.06 JP12.1
  Bottom 0.152: v20.88,82.75 20.27,82.14 13.26,82.14 JP964.P$1
32_1440127248  (via drill 0.3)
  Top 0.152: v56.69,81.53 v62.03,81.53
  Bottom 0.152: v62.03,81.53 62.48,81.99 66.75,81.99 JP1024.P$1 | v56.69,81.53 56.08,81.53 55.93,81.69 54.25,81.69 53.03,82.91 JP19.1
33_1440127218  (via drill 0.3)
  Top 0.152: v11.12,80.16 10.52,80.77 10.52,81.08 10.97,81.53 21.64,81.53 v23.62,83.52
  Bottom 0.152: v11.12,80.16 11.58,79.7 13.11,79.7 JP966.P$1 | v23.62,83.52 23.93,83.52 24.54,84.12 25.6,84.12 26.36,83.36 26.36,81.69 27.58,80.47 JP22.1
33_1440127248
  Bottom 0.152: JP1026.P$1 66.75,79.55 56.39,79.55 55.93,79.1 54.25,79.1 53.03,80.31 JP29.1
34_1440127218  (via drill 0.3)
  Top 0.152: v22.55,77.11 24.54,79.1 25.6,79.1 26.82,77.88 27.58,77.88 JP32.1
  Bottom 0.152: v22.55,77.11 13.26,77.11 JP968.P$1
34_1440127248
  Bottom 0.152: JP1028.P$1 66.75,76.96 56.39,76.96 56.08,76.66 54.1,76.66 53.03,77.72 JP39.1
35_1440127218  (via drill 0.3)
  Top 0.152: v11.12,74.98 10.52,75.59 10.52,75.89 11.12,76.5 v23.77,76.5